# EAGLE design vidc_interposer1 (EAGLE 9.4.2)
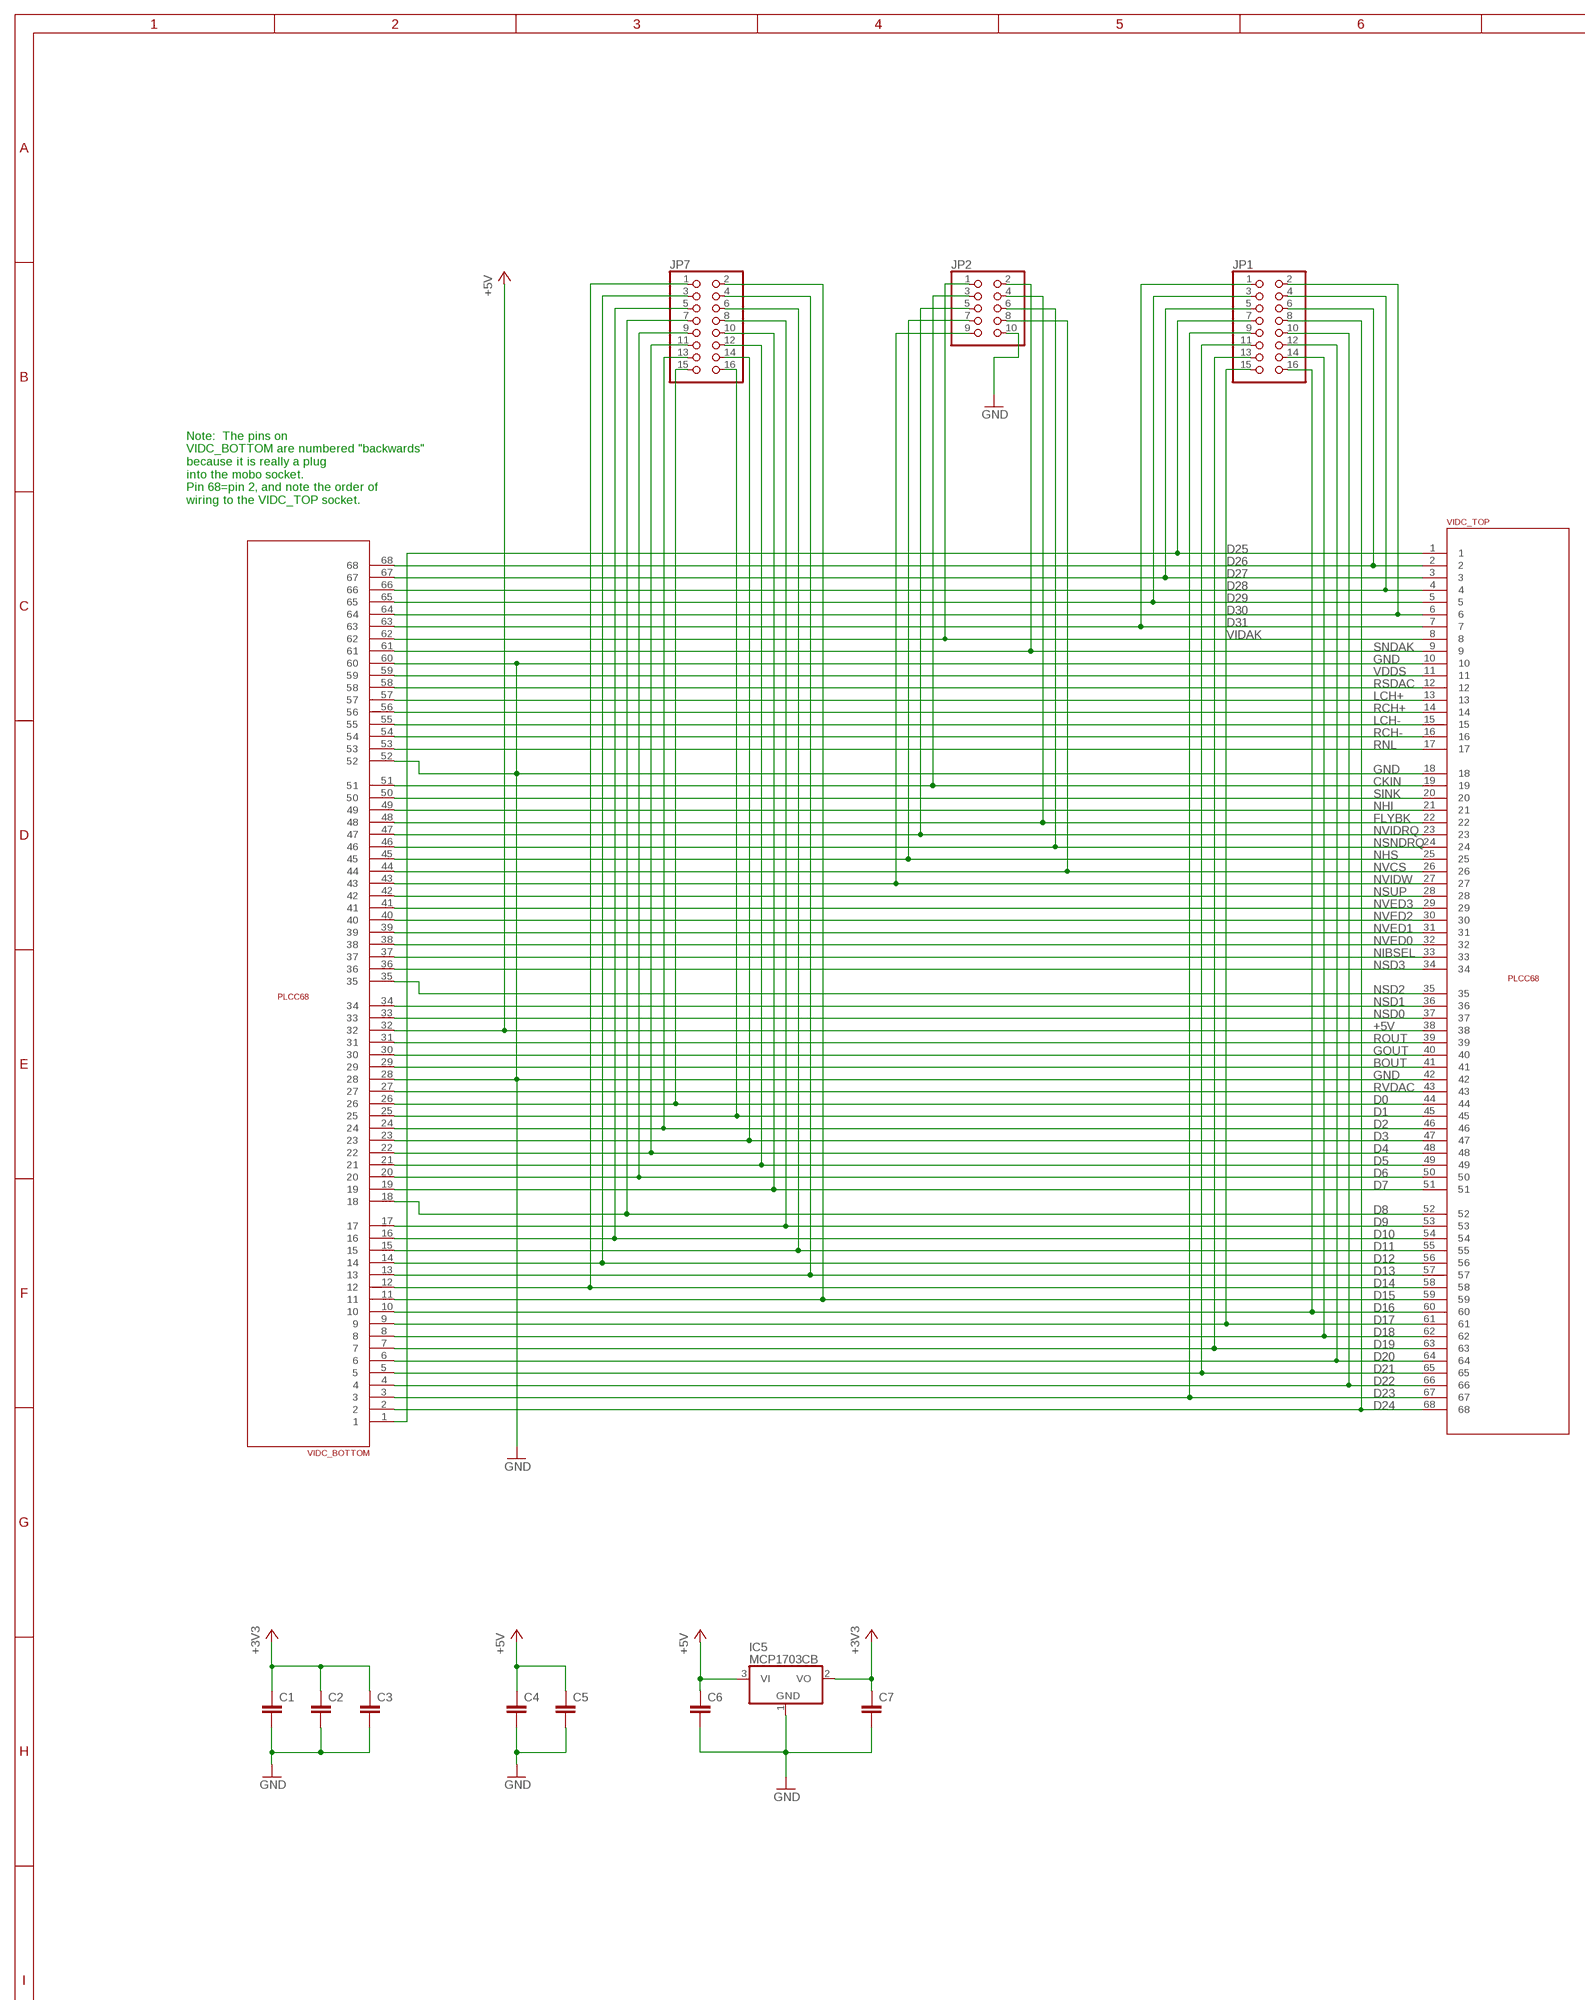
[diagram p0: schematic, sheet 1, part 1 of 2]
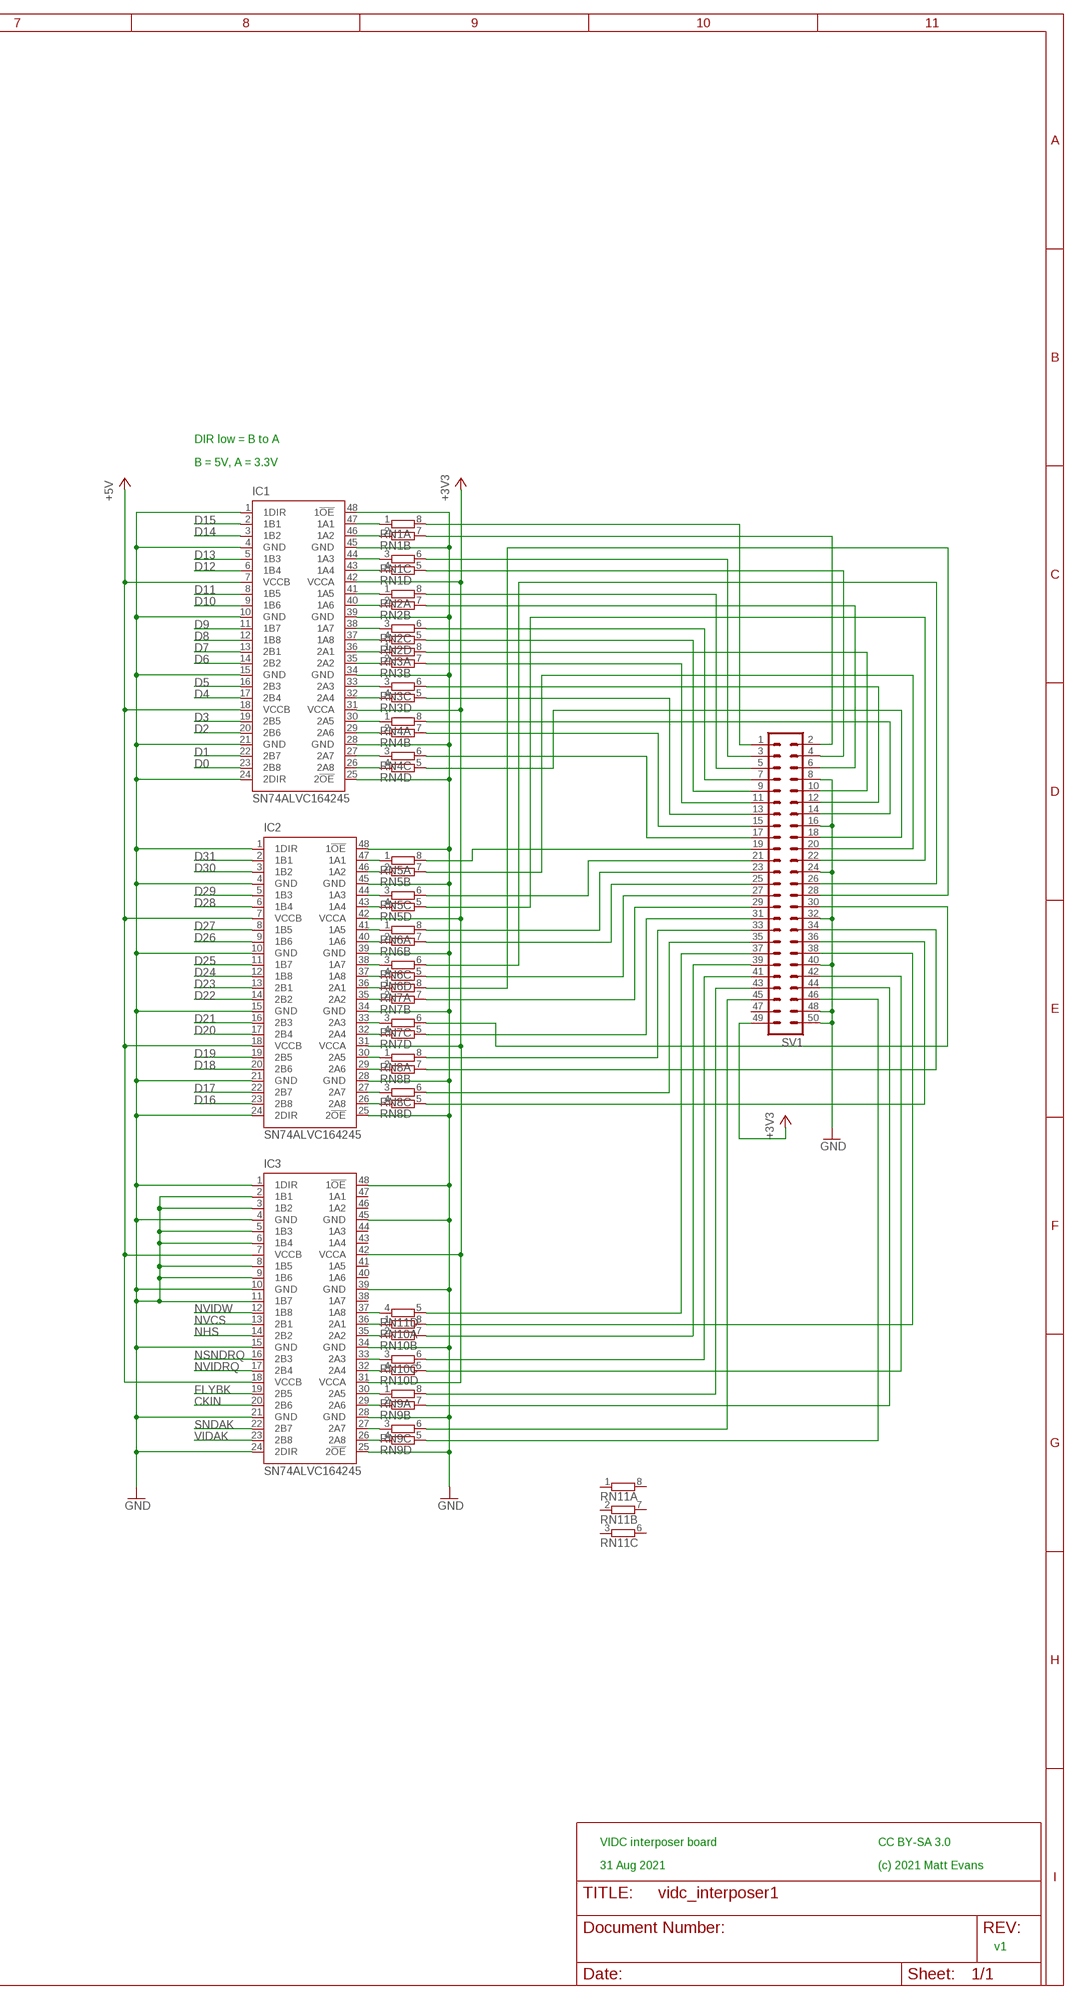
[diagram p1: schematic, sheet 1, part 2 of 2]

## Parts
C1  C-EUC0805  [C0805]
C2  C-EUC0805  [C0805]
C3  C-EUC0805  [C0805]
C4  C-EUC0805  [C0805]
C5  C-EUC0805  [C0805]
C6  C-EUC0805  [C0805]
C7  C-EUC0805  [C0805]
IC1  SN74ALVC164245  [DL_R-PDSO-G48]
IC2  SN74ALVC164245  [DL_R-PDSO-G48]
IC3  SN74ALVC164245  [DL_R-PDSO-G48]
IC5  MCP1703CB  [SOT23]
JP1  PINHD-2X8  [2X08]
JP2  PINHD-2X5  [2X05]
JP7  PINHD-2X8  [2X08]
RN1  4R-NCAY16  [CAY16]
RN2  4R-NCAY16  [CAY16]
RN3  4R-NCAY16  [CAY16]
RN4  4R-NCAY16  [CAY16]
RN5  4R-NCAY16  [CAY16]
RN6  4R-NCAY16  [CAY16]
RN7  4R-NCAY16  [CAY16]
RN8  4R-NCAY16  [CAY16]
RN9  4R-NCAY16  [CAY16]
RN10  4R-NCAY16  [CAY16]
RN11  4R-NCAY16  [CAY16]
SV1  ML50  [ML50]
VIDC_BOTTOM  RAW_PLCC68  [PLCC68S]
VIDC_TOP  RAW_PLCC68  [PLCC68S]

## Nets
+3V3: C1.1 C2.1 C3.1 C7.1 IC1.31(VCCA) IC1.42(VCCA) IC2.31(VCCA) IC2.42(VCCA) IC3.31(VCCA) IC3.42(VCCA) IC5.2(VO) SV1.49
+5V: C4.1 C5.1 C6.1 IC1.7(VCCB) IC1.18(VCCB) IC2.7(VCCB) IC2.18(VCCB) IC3.7(VCCB) IC3.18(VCCB) IC5.3(VI) VIDC_BOTTOM.32 VIDC_TOP.38
BOUT: VIDC_BOTTOM.29 VIDC_TOP.41
CKIN: IC3.20(2B6) JP2.3 VIDC_BOTTOM.51 VIDC_TOP.19
D0: IC1.23(2B8) JP7.15 VIDC_BOTTOM.26 VIDC_TOP.44
D1: IC1.22(2B7) JP7.16 VIDC_BOTTOM.25 VIDC_TOP.45
D2: IC1.20(2B6) JP7.13 VIDC_BOTTOM.24 VIDC_TOP.46
D3: IC1.19(2B5) JP7.14 VIDC_BOTTOM.23 VIDC_TOP.47
D4: IC1.17(2B4) JP7.11 VIDC_BOTTOM.22 VIDC_TOP.48
D5: IC1.16(2B3) JP7.12 VIDC_BOTTOM.21 VIDC_TOP.49
D6: IC1.14(2B2) JP7.9 VIDC_BOTTOM.20 VIDC_TOP.50
D7: IC1.13(2B1) JP7.10 VIDC_BOTTOM.19 VIDC_TOP.51
D8: IC1.12(1B8) JP7.7 VIDC_BOTTOM.18 VIDC_TOP.52
D9: IC1.11(1B7) JP7.8 VIDC_BOTTOM.17 VIDC_TOP.53
D10: IC1.9(1B6) JP7.5 VIDC_BOTTOM.16 VIDC_TOP.54
D11: IC1.8(1B5) JP7.6 VIDC_BOTTOM.15 VIDC_TOP.55
D12: IC1.6(1B4) JP7.3 VIDC_BOTTOM.14 VIDC_TOP.56
D13: IC1.5(1B3) JP7.4 VIDC_BOTTOM.13 VIDC_TOP.57
D14: IC1.3(1B2) JP7.1 VIDC_BOTTOM.12 VIDC_TOP.58
D15: IC1.2(1B1) JP7.2 VIDC_BOTTOM.11 VIDC_TOP.59
D16: IC2.23(2B8) JP1.16 VIDC_BOTTOM.10 VIDC_TOP.60
D17: IC2.22(2B7) JP1.15 VIDC_BOTTOM.9 VIDC_TOP.61
D18: IC2.20(2B6) JP1.14 VIDC_BOTTOM.8 VIDC_TOP.62
D19: IC2.19(2B5) JP1.13 VIDC_BOTTOM.7 VIDC_TOP.63
D20: IC2.17(2B4) JP1.12 VIDC_BOTTOM.6 VIDC_TOP.64
D21: IC2.16(2B3) JP1.11 VIDC_BOTTOM.5 VIDC_TOP.65
D22: IC2.14(2B2) JP1.10 VIDC_BOTTOM.4 VIDC_TOP.66
D23: IC2.13(2B1) JP1.9 VIDC_BOTTOM.3 VIDC_TOP.67
D24: IC2.12(1B8) JP1.8 VIDC_BOTTOM.2 VIDC_TOP.68
D25: IC2.11(1B7) JP1.7 VIDC_BOTTOM.1 VIDC_TOP.1
D26: IC2.9(1B6) JP1.6 VIDC_BOTTOM.68 VIDC_TOP.2
D27: IC2.8(1B5) JP1.5 VIDC_BOTTOM.67 VIDC_TOP.3
D28: IC2.6(1B4) JP1.4 VIDC_BOTTOM.66 VIDC_TOP.4
D29: IC2.5(1B3) JP1.3 VIDC_BOTTOM.65 VIDC_TOP.5
D30: IC2.3(1B2) JP1.2 VIDC_BOTTOM.64 VIDC_TOP.6
D31: IC2.2(1B1) JP1.1 VIDC_BOTTOM.63 VIDC_TOP.7
FLYBK: IC3.19(2B5) JP2.4 VIDC_BOTTOM.48 VIDC_TOP.22
GND: C1.2 C2.2 C3.2 C4.2 C5.2 C6.2 C7.2 IC1.1(1DIR) IC1.4(GND) IC1.10(GND) IC1.15(GND) IC1.21(GND) IC1.24(2DIR) IC1.25(2!OE) IC1.28(GND) IC1.34(GND) IC1.39(GND) IC1.45(GND) IC1.48(1!OE) IC2.1(1DIR) IC2.4(GND) IC2.10(GND) IC2.15(GND) IC2.21(GND) IC2.24(2DIR) IC2.25(2!OE) IC2.28(GND) IC2.34(GND) IC2.39(GND) IC2.45(GND) IC2.48(1!OE) IC3.1(1DIR) IC3.2(1B1) IC3.3(1B2) IC3.4(GND) IC3.5(1B3) IC3.6(1B4) IC3.8(1B5) IC3.9(1B6) IC3.10(GND) IC3.11(1B7) IC3.15(GND) IC3.21(GND) IC3.24(2DIR) IC3.25(2!OE) IC3.28(GND) IC3.34(GND) IC3.39(GND) IC3.45(GND) IC3.48(1!OE) IC5.1(GND) JP2.10 SV1.8 SV1.16 SV1.24 SV1.32 SV1.40 SV1.48 SV1.50 VIDC_BOTTOM.28 VIDC_BOTTOM.52 VIDC_BOTTOM.60 VIDC_TOP.10 VIDC_TOP.18 VIDC_TOP.42
GOUT: VIDC_BOTTOM.30 VIDC_TOP.40
LCH+: VIDC_BOTTOM.57 VIDC_TOP.13
LCH-: VIDC_BOTTOM.55 VIDC_TOP.15
N$1: IC3.26(2A8) RN9.4
N$2: IC3.27(2A7) RN9.3
N$3: IC3.29(2A6) RN9.2
N$4: IC3.30(2A5) RN9.1
N$5: IC3.32(2A4) RN10.4
N$6: IC3.33(2A3) RN10.3
N$7: IC3.35(2A2) RN10.2
N$8: IC3.36(2A1) RN10.1
N$9: IC1.47(1A1) RN1.1
N$10: IC1.46(1A2) RN1.2
N$11: IC1.44(1A3) RN1.3
N$12: IC1.43(1A4) RN1.4
N$13: IC1.41(1A5) RN2.1
N$14: IC1.40(1A6) RN2.2
N$15: IC1.38(1A7) RN2.3
N$16: IC1.37(1A8) RN2.4
N$17: IC1.36(2A1) RN3.1
N$18: IC1.35(2A2) RN3.2
N$19: IC1.33(2A3) RN3.3
N$20: IC1.32(2A4) RN3.4
N$21: IC1.30(2A5) RN4.1
N$22: IC1.29(2A6) RN4.2
N$23: IC3.37(1A8) RN11.4
N$24: IC1.27(2A7) RN4.3
N$25: IC1.26(2A8) RN4.4
N$26: IC2.47(1A1) RN5.1
N$27: IC2.46(1A2) RN5.2
N$28: IC2.44(1A3) RN5.3
N$29: IC2.43(1A4) RN5.4
N$30: IC2.41(1A5) RN6.1
N$31: IC2.40(1A6) RN6.2
N$32: IC2.38(1A7) RN6.3
N$33: IC2.37(1A8) RN6.4
N$34: IC2.36(2A1) RN7.1
N$35: IC2.35(2A2) RN7.2
N$36: IC2.33(2A3) RN7.3
N$37: IC2.32(2A4) RN7.4
N$38: IC2.30(2A5) RN8.1
N$39: IC2.29(2A6) RN8.2
N$40: IC2.27(2A7) RN8.3
N$41: IC2.26(2A8) RN8.4
N$42: RN1.8 SV1.1
N$43: RN1.7 SV1.2
N$44: RN1.6 SV1.3
N$45: RN1.5 SV1.4
N$46: RN5.8 SV1.19
N$47: RN2.8 SV1.5
N$48: RN2.7 SV1.6
N$49: RN2.6 SV1.7
N$50: RN2.5 SV1.9
N$51: RN3.7 SV1.11
N$52: RN5.7 SV1.20
N$53: RN3.8 SV1.10
N$54: RN3.5 SV1.13
N$55: RN3.6 SV1.12
N$56: RN4.7 SV1.15
N$57: RN4.8 SV1.14
N$58: RN4.6 SV1.17
N$59: RN5.5 SV1.22
N$60: RN5.6 SV1.21
N$61: RN4.5 SV1.18
N$62: RN8.5 SV1.36
N$63: RN10.8 SV1.38
N$64: RN6.6 SV1.26
N$65: RN6.8 SV1.23
N$66: RN7.8 SV1.28
N$67: RN6.7 SV1.25
N$68: RN11.5 SV1.37
N$69: RN10.5 SV1.42
N$70: RN6.5 SV1.27
N$71: RN10.7 SV1.39
N$72: RN9.7 SV1.44
N$73: RN9.8 SV1.43
N$86: RN7.7 SV1.29
N$87: RN9.6 SV1.45
N$88: RN7.6 SV1.30
N$89: RN8.7 SV1.34
N$91: RN10.6 SV1.41
N$93: RN7.5 SV1.31
N$94: RN8.8 SV1.33
N$95: RN8.6 SV1.35
N$96: RN9.5 SV1.46
NHI: VIDC_BOTTOM.49 VIDC_TOP.21
NHS: IC3.14(2B2) JP2.7 VIDC_BOTTOM.45 VIDC_TOP.25
NIBSEL: VIDC_BOTTOM.37 VIDC_TOP.33
NSD0: VIDC_BOTTOM.33 VIDC_TOP.37
NSD1: VIDC_BOTTOM.34 VIDC_TOP.36
NSD2: VIDC_BOTTOM.35 VIDC_TOP.35
NSD3: VIDC_BOTTOM.36 VIDC_TOP.34
NSNDRQ: IC3.16(2B3) JP2.6 VIDC_BOTTOM.46 VIDC_TOP.24
NSUP: VIDC_BOTTOM.42 VIDC_TOP.28
NVCS: IC3.13(2B1) JP2.8 VIDC_BOTTOM.44 VIDC_TOP.26
NVED0: VIDC_BOTTOM.38 VIDC_TOP.32
NVED1: VIDC_BOTTOM.39 VIDC_TOP.31
NVED2: VIDC_BOTTOM.40 VIDC_TOP.30
NVED3: VIDC_BOTTOM.41 VIDC_TOP.29
NVIDRQ: IC3.17(2B4) JP2.5 VIDC_BOTTOM.47 VIDC_TOP.23
NVIDW: IC3.12(1B8) JP2.9 VIDC_BOTTOM.43 VIDC_TOP.27
RCH+: VIDC_BOTTOM.56 VIDC_TOP.14
RCH-: VIDC_BOTTOM.54 VIDC_TOP.16
RNL: VIDC_BOTTOM.53 VIDC_TOP.17
ROUT: VIDC_BOTTOM.31 VIDC_TOP.39
RSDAC: VIDC_BOTTOM.58 VIDC_TOP.12
RVDAC: VIDC_BOTTOM.27 VIDC_TOP.43
SINK: VIDC_BOTTOM.50 VIDC_TOP.20
SNDAK: IC3.22(2B7) JP2.2 VIDC_BOTTOM.61 VIDC_TOP.9
VDDS: VIDC_BOTTOM.59 VIDC_TOP.11
VIDAK: IC3.23(2B8) JP2.1 VIDC_BOTTOM.62 VIDC_TOP.8
Unconnected: IC3.38(1A7) IC3.40(1A6) IC3.41(1A5) IC3.43(1A4) IC3.44(1A3) IC3.46(1A2) IC3.47(1A1) RN11.1 RN11.2 RN11.3 RN11.6 RN11.7 RN11.8 SV1.47

## Notes on the sheet
- DIR low = B to A
- B = 5V, A = 3.3V
- Note:  The pins on
  VIDC_BOTTOM are numbered "backwards"
  because it is really a plug
  into the mobo socket.
  Pin 68=pin 2, and note the order of
  wiring to the VIDC_TOP socket.
- VIDC interposer board | CC BY-SA 3.0
- 31 Aug 2021 | (c) 2021 Matt Evans
- v1

## Library data of the parts
C1-C7 = rcl:C-EU: CAPACITOR, European symbol
IC1-IC3 = matt:SN74ALVC164245: 16-BIT BUS TRANSCEIVER WITH 3-STATE OUTPUTS Auto generated by make-symbol-device-package-bsdl.ulp Rev. 33 Source: http://focus.ti.com/lit/ds/symlink/sn74lvcr162245.pdf; MPN: SN74LVCR162245DL; OC_FARNELL: 1739707; OC_NEWARK: 50R6613
IC5 = linear:MCP1703: 250 mA, 16V, Low Quiescent Current LDO Regulator Source: http://ww1.microchip.com/downloads/en/DeviceDoc/22049b.pdf
JP1 JP7 = matt:PINHD-2X8: PIN HEADER
JP2 = pinhead:PINHD-2X5: PIN HEADER
RN1-RN11 = resistor-dil:4R-N: Array Chip Resistor Source: RS Component / Phycomp; OC_FARNELL: unknown; OC_NEWARK: unknown
SV1 = con-harting-ml:ML50: HARTING; OC_FARNELL: unknown; OC_NEWARK: unknown
VIDC_BOTTOM VIDC_TOP = matt:RAW_PLCC68: PLCC68 raw footprint

## Board
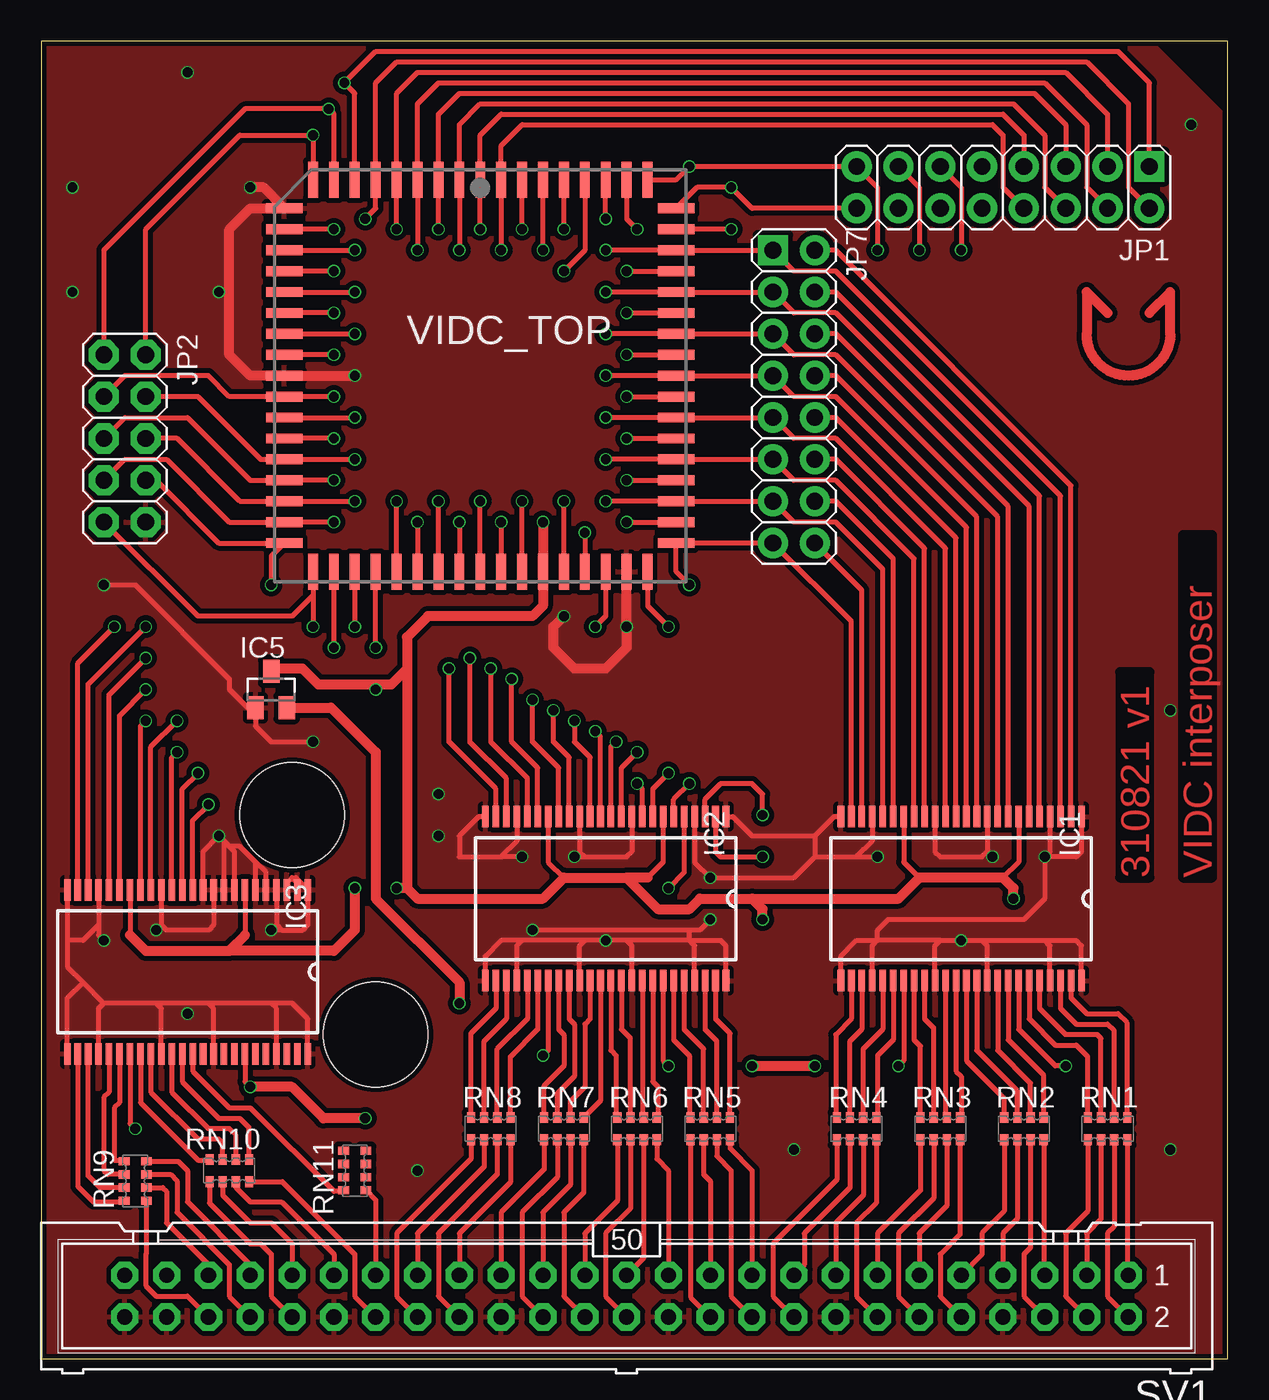
[diagram p2: board, top side]
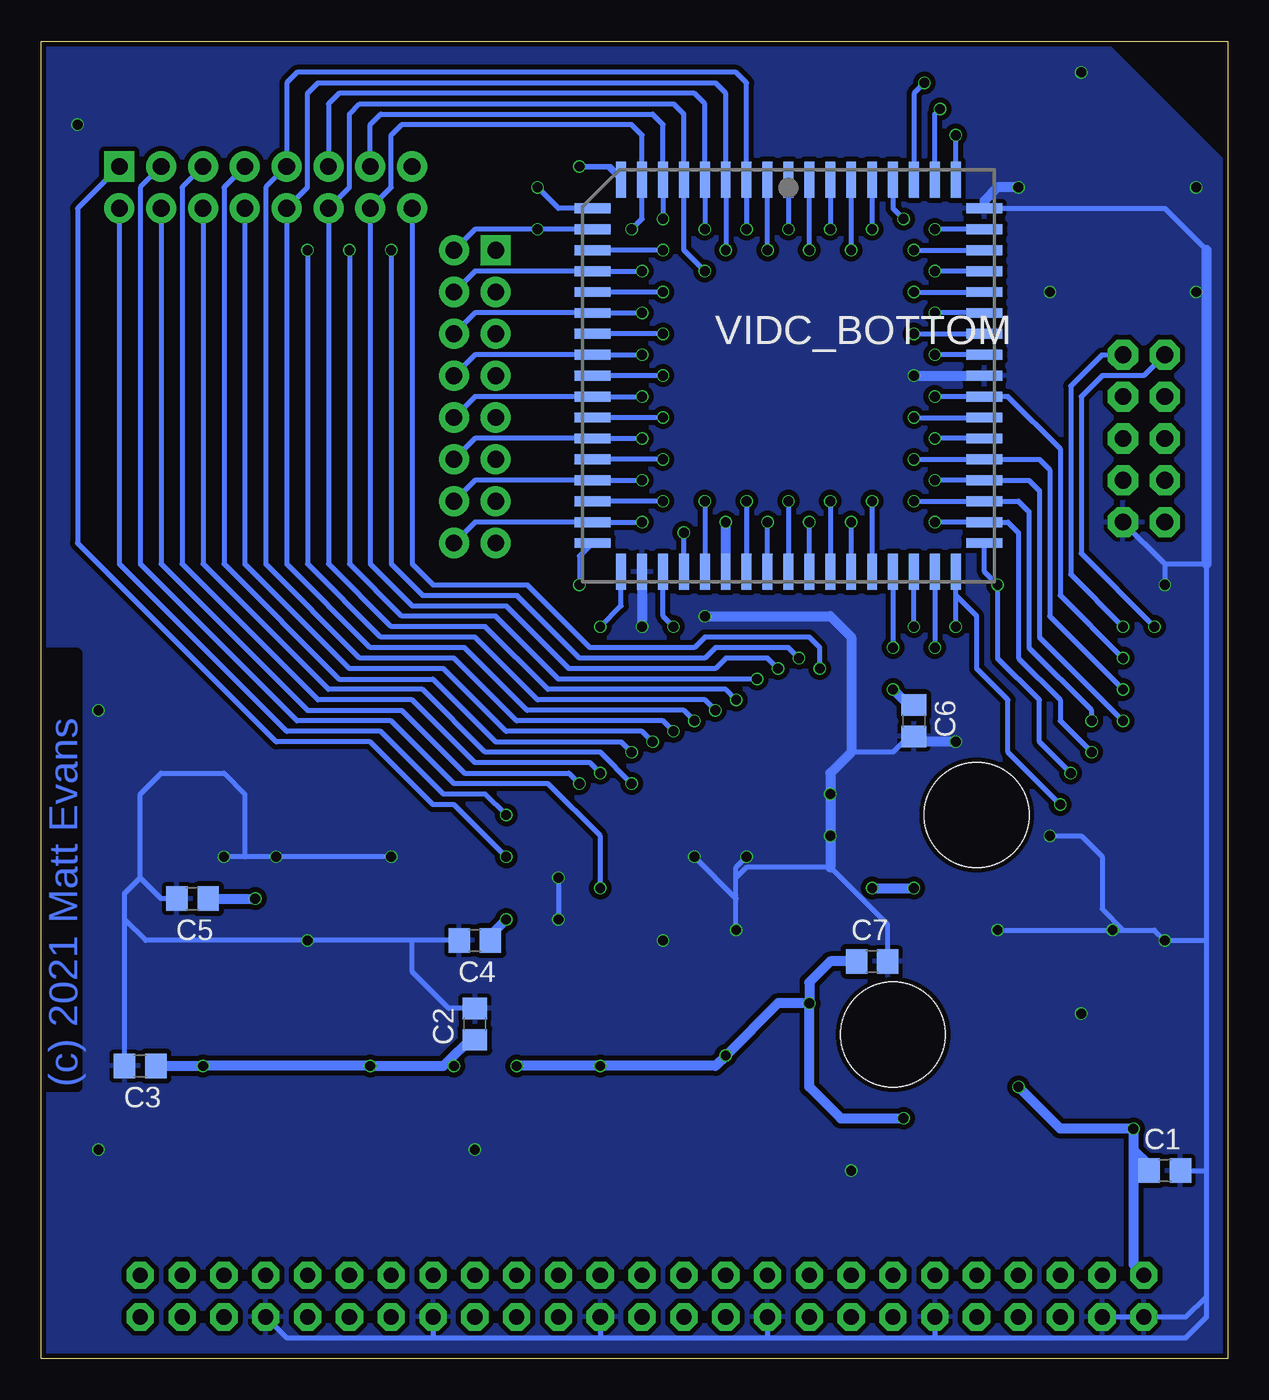
[diagram p3: board, bottom side, seen from below]

Size 72.06 x 80 mm. Coordinates in mm from the lower left corner, seen from the top.
Outline: 0,0 72.06,0 72.06,80 0,80 0,0
Copper layers (1*16): Top 0.035mm / dielectric 1.6mm / Bottom 0.035mm
Design rules "jlcpcb-2layers": minimum track width 5mil, minimum drill 0.3mm, track to track 5mil, track to pad 5mil, pad to pad 5mil, via to via 5mil, smd to smd 5mil, copper to edge 0.2mm, drill to drill 6mil, minimum pad ring 10mil, minimum via ring 3mil, stop-mask expansion 4mil, vias tented up to drill 0mil, thermal gap 10mil
Holes 6.35 mm at 15.24,33.02 20.32,19.68

### Footprints (pad centres in the part's own frame; a part is rotated, then mirrored left to right if it is on the bottom)
C0805 = smd 1.3 x 1.5: 1 -0.95,0; 2 0.95,0
DL_R-PDSO-G48 = smd 1.3 x 0.4: 1 -4.98,7.303; 2 -4.98,6.668; 3 -4.98,6.032; 4 -4.98,5.397; 5 -4.98,4.763; 6 -4.98,4.128; 7 -4.98,3.493; 8 -4.98,2.857; 9 -4.98,2.223; 10 -4.98,1.587; 11 -4.98,0.953; 12 -4.98,0.318; 13 -4.98,-0.318; 14 -4.98,-0.953; 15 -4.98,-1.587; 16 -4.98,-2.223; 17 -4.98,-2.857; 18 -4.98,-3.493; 19 -4.98,-4.128; 20 -4.98,-4.763; 21 -4.98,-5.397; 22 -4.98,-6.032; 23 -4.98,-6.668; 24 -4.98,-7.303; 25 4.98,-7.303; 26 4.98,-6.668; 27 4.98,-6.032; 28 4.98,-5.397; 29 4.98,-4.763; 30 4.98,-4.128; 31 4.98,-3.493; 32 4.98,-2.857; 33 4.98,-2.223; 34 4.98,-1.587; 35 4.98,-0.953; 36 4.98,-0.318; 37 4.98,0.318; 38 4.98,0.953; 39 4.98,1.587; 40 4.98,2.223; 41 4.98,2.857; 42 4.98,3.493; 43 4.98,4.128; 44 4.98,4.763; 45 4.98,5.397; 46 4.98,6.032; 47 4.98,6.668; 48 4.98,7.303
SOT23 = smd 1 x 1.4: 1 -0.95,-1.1; 2 0.95,-1.1; 3 0,1.1
2X08 = drill 1.016 square: 1 -8.89,-1.27 | drill 1.016 pad 1.676: 2 -8.89,1.27; 3 -6.35,-1.27; 4 -6.35,1.27; 5 -3.81,-1.27; 6 -3.81,1.27; 7 -1.27,-1.27; 8 -1.27,1.27; 9 1.27,-1.27; 10 1.27,1.27; 11 3.81,-1.27; 12 3.81,1.27; 13 6.35,-1.27; 14 6.35,1.27; 15 8.89,-1.27; 16 8.89,1.27
2X05 = drill 1.016 octagon: 1 -5.08,-1.27; 2 -5.08,1.27; 3 -2.54,-1.27; 4 -2.54,1.27; 5 0,-1.27; 6 0,1.27; 7 2.54,-1.27; 8 2.54,1.27; 9 5.08,-1.27; 10 5.08,1.27
CAY16 = smd 0.5 x 0.65: 1 -1.2,-0.675; 2 -0.4,-0.675; 3 0.4,-0.675; 4 1.2,-0.675; 5 1.2,0.675; 6 0.4,0.675; 7 -0.4,0.675; 8 -1.2,0.675
ML50 = drill 0.914 octagon: 1 -30.48,-1.27; 2 -30.48,1.27; 3 -27.94,-1.27; 4 -27.94,1.27; 5 -25.4,-1.27; 6 -25.4,1.27; 7 -22.86,-1.27; 8 -22.86,1.27; 9 -20.32,-1.27; 10 -20.32,1.27; 11 -17.78,-1.27; 12 -17.78,1.27; 13 -15.24,-1.27; 14 -15.24,1.27; 15 -12.7,-1.27; 16 -12.7,1.27; 17 -10.16,-1.27; 18 -10.16,1.27; 19 -7.62,-1.27; 20 -7.62,1.27; 21 -5.08,-1.27; 22 -5.08,1.27; 23 -2.54,-1.27; 24 -2.54,1.27; 25 0,-1.27; 26 0,1.27; 27 2.54,-1.27; 28 2.54,1.27; 29 5.08,-1.27; 30 5.08,1.27; 31 7.62,-1.27; 32 7.62,1.27; 33 10.16,-1.27; 34 10.16,1.27; 35 12.7,-1.27; 36 12.7,1.27; 37 15.24,-1.27; 38 15.24,1.27; 39 17.78,-1.27; 40 17.78,1.27; 41 20.32,-1.27; 42 20.32,1.27; 43 22.86,-1.27; 44 22.86,1.27; 45 25.4,-1.27; 46 25.4,1.27; 47 27.94,-1.27; 48 27.94,1.27; 49 30.48,-1.27; 50 30.48,1.27
PLCC68S = smd 0.6 x 2.2: 1 0,11.9; 2 -1.27,11.9; 3 -2.54,11.9; 4 -3.81,11.9; 5 -5.08,11.9; 6 -6.35,11.9; 7 -7.62,11.9; 8 -8.89,11.9; 9 -10.16,11.9; 27 -10.16,-11.9; 28 -8.89,-11.9; 29 -7.62,-11.9; 30 -6.35,-11.9; 31 -5.08,-11.9; 32 -3.81,-11.9; 33 -2.54,-11.9; 34 -1.27,-11.9; 35 0,-11.9; 36 1.27,-11.9; 37 2.54,-11.9; 38 3.81,-11.9; 39 5.08,-11.9; 40 6.35,-11.9; 41 7.62,-11.9; 42 8.89,-11.9; 43 10.16,-11.9; 61 10.16,11.9; 62 8.89,11.9; 63 7.62,11.9; 64 6.35,11.9; 65 5.08,11.9; 66 3.81,11.9; 67 2.54,11.9; 68 1.27,11.9 | smd 2.2 x 0.6: 10 -11.9,10.16; 11 -11.9,8.89; 12 -11.9,7.62; 13 -11.9,6.35; 14 -11.9,5.08; 15 -11.9,3.81; 16 -11.9,2.54; 17 -11.9,1.27; 18 -11.9,0; 19 -11.9,-1.27; 20 -11.9,-2.54; 21 -11.9,-3.81; 22 -11.9,-5.08; 23 -11.9,-6.35; 24 -11.9,-7.62; 25 -11.9,-8.89; 26 -11.9,-10.16; 44 11.9,-10.16; 45 11.9,-8.89; 46 11.9,-7.62; 47 11.9,-6.35; 48 11.9,-5.08; 49 11.9,-3.81; 50 11.9,-2.54; 51 11.9,-1.27; 52 11.9,0; 53 11.9,1.27; 54 11.9,2.54; 55 11.9,3.81; 56 11.9,5.08; 57 11.9,6.35; 58 11.9,7.62; 59 11.9,8.89; 60 11.9,10.16

### Placement (x,y rotation side)
C1  3.81,11.43 0 bottom
C2  45.72,20.32 90 bottom
C3  66.04,17.78 180 bottom
C4  45.72,25.4 180 bottom
C5  62.87,27.94 180 bottom
C6  19.05,38.73 270 bottom
C7  21.59,24.13 0 bottom
IC1  55.88,27.94 270 top
IC2  34.29,27.94 270 top
IC3  8.89,23.5 270 top
IC5  13.97,40.64 0 top
JP1  58.42,71.12 180 top
JP2  5.08,55.88 270 top
JP7  45.72,58.42 270 top
RN1  64.77,13.97 180 top
RN2  59.69,13.97 180 top
RN3  54.61,13.97 180 top
RN4  49.53,13.97 180 top
RN5  40.64,13.97 180 top
RN6  36.2,13.97 180 top
RN7  31.75,13.97 180 top
RN8  27.3,13.97 180 top
RN9  5.71,10.79 270 top
RN10  11.43,11.43 180 top
RN11  19.05,11.43 270 top
SV1  35.56,3.81 180 top
VIDC_BOTTOM  26.67,59.69 0 bottom
VIDC_TOP  26.67,59.69 0 top

### Tracks (layer width: path | path; a pad name or v marks a point on that pad's centre or on a via)
+3V3  (via drill 0.6)
  Top 0.305: IC1.42 59.37,20 61.59,17.78 v62.23,17.78 | IC1.31 52.39,18.1 v52.07,17.78 | IC2.42 37.78,18.1 v38.1,17.78 | IC2.31 30.8,18.73 v30.48,18.41 | IC3.42 12.38,16.83 v12.7,16.51 | IC3.31 5.4,14.29 v5.71,13.97
  Top 0.61: v43.18,17.78 v46.99,17.78 | v25.4,21.59 25.4,22.86 20.32,27.94 20.32,36.83 17.61,39.54 IC5.2 | v19.68,14.61 17.14,14.61 15.24,16.51 v12.7,16.51
  Bottom 0.305: 45.72,19.68 C2.1 | v46.99,17.78 47.62,17.78 | C1.1 4.76,11.74
  Bottom 0.61: C3.1 v62.23,17.78 v52.07,17.78 47.62,17.78 45.72,19.68 | v43.18,17.78 v38.1,17.78 31.11,17.78 v30.48,18.41 27.3,21.59 v25.4,21.59 | v12.7,16.51 10.16,13.97 v5.71,13.97 5.71,12.7 | 5.71,12.7 5.71,5.71 SV1.49 | v25.4,21.59 25.4,16.51 23.5,14.61 v19.68,14.61 | 4.76,11.74 5.71,12.7 | C7.1 24.13,24.13 25.4,22.86 v25.4,21.59
+5V  (via drill 0.6)
  Top 0.305: IC1.7 59.37,30.16 58.42,29.21 | 53.34,29.21 52.39,30.16 IC1.18 | IC2.7 37.78,30.16 36.83,29.21 | IC2.18 30.8,30.16 31.75,29.21 | 14.14,41.91 IC5.3 | v20.32,40.64 v20.32,40.63 20,40.95 | IC3.18 5.4,25.72 | IC3.7 12.38,25.72
  Top 0.61: v30.48,50.8 VIDC_BOTTOM.32 30.48,45.72 29.84,45.09 23.5,45.09 22.23,43.81 22.23,41.91 | 22.23,41.91 22.23,28.57 | 22.23,28.57 22.86,27.94 30.48,27.94 31.75,29.21 35.56,29.21 | 43.18,27.94 40.01,27.94 39.37,27.3 37.47,27.3 35.56,29.21 | 43.18,27.94 52.07,27.94 53.34,29.21 58.42,29.21 59.05,28.57 v59.05,27.94 | v43.81,26.67 43.81,27.3 43.18,27.94 | 14.14,41.91 15.88,41.91 16.83,40.95 20,40.95 21.27,40.95 22.23,41.91 | 5.4,25.72 6.35,24.77 11.43,24.77 | 12.38,25.72 11.43,24.77 | 22.23,28.57 v21.59,28.57 | v19.05,28.57 19.05,26.04 17.78,24.77 11.43,24.77 | 36.83,29.21 35.56,29.21
  Bottom 0.305: C4.1 44.77,25.71 | C6.1 19.36,39.69
  Bottom 0.61: VIDC_BOTTOM.32 v30.48,50.8 | C5.1 v59.05,27.94 | 44.77,25.71 v43.81,26.67 | 19.36,39.69 v20.32,40.64 | v21.59,28.57 v19.05,28.57
BOUT  (via drill 0.6)
  Top 0.305: VIDC_BOTTOM.29 34.29,45.09 v33.66,44.45
  Bottom 0.305: v33.66,44.45 34.29,45.09 VIDC_BOTTOM.29
CKIN  (via drill 0.6)
  Top 0.305: v17.78,58.42 VIDC_BOTTOM.51 11.43,58.42 10.16,59.69 5.08,59.69 JP2.3 | IC3.20 4.13,40.32 v6.35,42.55
  Bottom 0.305: v17.78,58.42 VIDC_BOTTOM.51 13.34,58.42 10.16,55.24 10.16,46.35 v6.35,42.55
D0  (via drill 0.6)
  Top 0.305: v39.37,46.99 38.57,47.79 VIDC_BOTTOM.26 JP7.15 49.21,44.77 IC1.23
  Bottom 0.305: VIDC_BOTTOM.26 39.37,48.73 v39.37,46.99
D1  (via drill 0.6)
  Top 0.305: v35.56,50.8 VIDC_BOTTOM.25 | IC1.22 49.85,46.67 JP7.16
  Bottom 0.305: v35.56,50.8 VIDC_BOTTOM.25 45.72,50.8 JP7.16
D2  (via drill 0.6)
  Top 0.305: v34.29,52.07 VIDC_BOTTOM.24 JP7.13 45.72,50.8 48.26,50.8 51.12,47.94 IC1.20
  Bottom 0.305: v34.29,52.07 VIDC_BOTTOM.24
D3  (via drill 0.6)
  Top 0.305: v35.56,53.34 VIDC_BOTTOM.23 | IC1.19 51.75,48.58 48.26,52.07 JP7.14
  Bottom 0.305: v35.56,53.34 VIDC_BOTTOM.23 45.72,53.34 JP7.14
D4  (via drill 0.6)
  Top 0.305: v34.29,54.61 VIDC_BOTTOM.22 JP7.11 45.72,53.34 48.26,53.34 53.02,48.58 IC1.17
  Bottom 0.305: v34.29,54.61 VIDC_BOTTOM.22
D5  (via drill 0.6)
  Top 0.305: v35.56,55.88 VIDC_BOTTOM.21 | IC1.16 53.66,49.21 48.26,54.61 JP7.12
  Bottom 0.305: v35.56,55.88 VIDC_BOTTOM.21 45.72,55.88 JP7.12
D6  (via drill 0.6)
  Top 0.305: v34.29,57.15 VIDC_BOTTOM.20 JP7.9 45.72,55.88 48.26,55.88 54.93,49.21 IC1.14
  Bottom 0.305: v34.29,57.15 VIDC_BOTTOM.20
D7  (via drill 0.6)
  Top 0.305: v35.56,58.42 VIDC_BOTTOM.19 | IC1.13 55.56,49.85 48.26,57.15 JP7.10
  Bottom 0.305: v35.56,58.42 VIDC_BOTTOM.19 45.72,58.42 JP7.10
D8  (via drill 0.6)
  Top 0.305: v34.29,59.69 VIDC_BOTTOM.18 JP7.7 45.72,58.42 48.26,58.42 56.2,50.48 IC1.12
  Bottom 0.305: v34.29,59.69 VIDC_BOTTOM.18
D9  (via drill 0.6)
  Top 0.305: v35.56,60.96 VIDC_BOTTOM.17 | IC1.11 56.83,51.12 48.26,59.69 JP7.8
  Bottom 0.305: v35.56,60.96 VIDC_BOTTOM.17 45.72,60.96 JP7.8
D10  (via drill 0.6)
  Top 0.305: v34.29,62.23 VIDC_BOTTOM.16 JP7.5 45.72,60.96 48.26,60.96 58.1,51.12 IC1.9
  Bottom 0.305: v34.29,62.23 VIDC_BOTTOM.16
D11  (via drill 0.6)
  Top 0.305: v35.56,63.5 VIDC_BOTTOM.15 | IC1.8 58.74,51.75 48.26,62.23 JP7.6
  Bottom 0.305: v35.56,63.5 VIDC_BOTTOM.15 45.72,63.5 JP7.6
D12  (via drill 0.6)
  Top 0.305: v34.29,64.77 VIDC_BOTTOM.14 JP7.3 45.72,63.5 48.26,63.5 60.01,51.75 IC1.6
  Bottom 0.305: v34.29,64.77 VIDC_BOTTOM.14
D13  (via drill 0.6)
  Top 0.305: v35.56,66.04 VIDC_BOTTOM.13 | IC1.5 60.64,52.39 48.26,64.77 JP7.4
  Bottom 0.305: v35.56,66.04 VIDC_BOTTOM.13 45.72,66.04 JP7.4
D14  (via drill 0.6)
  Top 0.305: v34.29,67.31 VIDC_BOTTOM.12 JP7.1 45.72,66.04 48.26,66.04 61.91,52.39 IC1.3
  Bottom 0.305: v34.29,67.31 VIDC_BOTTOM.12
D15  (via drill 0.6)
  Top 0.305: v41.91,68.58 VIDC_BOTTOM.11 | IC1.2 62.55,53.02 48.26,67.31 JP7.2
  Bottom 0.305: VIDC_BOTTOM.11 v41.91,68.58 45.72,68.58 JP7.2
D16  (via drill 0.6)
  Top 0.305: VIDC_BOTTOM.10 39.84,71.12 v41.91,71.12 43.18,69.85 JP1.16 | IC2.23 27.62,34.61 24.77,37.47 v24.77,41.91
  Bottom 0.305: VIDC_BOTTOM.10 40.64,69.85 v41.91,71.12 | JP1.16 49.53,48.26 48.26,46.99 42.55,46.99 38.73,43.18 32.38,43.18 31.75,43.81 25.4,43.81 24.77,43.18 v24.77,41.91
D17  (via drill 0.6)
  Top 0.305: VIDC_BOTTOM.9 38.57,71.59 v39.37,72.39 JP1.15 50.8,71.12 v50.8,67.31 | v26.04,42.55 26.04,37.47 28.26,35.24 IC2.22
  Bottom 0.305: v50.8,67.31 50.8,48.26 48.9,46.35 43.18,46.35 39.37,42.55 31.75,42.55 31.11,43.18 26.67,43.18 v26.04,42.55 | v39.37,72.39 37.63,72.39 VIDC_BOTTOM.9 36.83,71.75 37.47,72.39 v39.37,72.39
D18  (via drill 0.6)
  Top 0.305: VIDC_BOTTOM.8 35.56,69.22 v36.2,68.58 | v27.3,41.91 27.3,37.47 29.53,35.24 IC2.20
  Bottom 0.305: v36.2,68.58 35.56,69.22 VIDC_BOTTOM.8 35.56,74.3 36.2,74.93 50.16,74.93 50.8,74.3 50.8,71.12 JP1.14 52.07,48.26 49.53,45.72 43.81,45.72 40.01,41.91 31.11,41.91 30.48,42.55 27.94,42.55 v27.3,41.91
D19  (via drill 0.6)
  Top 0.305: v34.29,69.22 VIDC_BOTTOM.7 | JP1.13 53.34,71.12 v53.34,67.31 | IC2.19 30.16,35.88 28.57,37.47 v28.57,41.27
  Bottom 0.305: v34.29,69.22 VIDC_BOTTOM.7 34.29,74.93 34.92,75.56 51.44,75.56 52.07,74.93 JP1.13 | v53.34,67.31 53.34,48.26 50.16,45.09 44.45,45.09 40.64,41.27 v28.57,41.27
D20  (via drill 0.6)
  Top 0.305: VIDC_BOTTOM.6 33.02,67.31 v31.75,66.04 | IC2.17 31.43,35.88 29.84,37.47 v29.84,40.01
  Bottom 0.305: v31.75,66.04 33.02,67.31 VIDC_BOTTOM.6 33.02,75.56 33.66,76.2 52.7,76.2 53.34,75.56 53.34,71.12 JP1.12 54.61,48.26 50.8,44.45 45.09,44.45 41.27,40.64 30.48,40.64 v29.84,40.01
D21  (via drill 0.6)
  Top 0.305: v31.75,68.58 VIDC_BOTTOM.5 | JP1.11 55.88,71.12 v55.88,67.31 | IC2.16 32.07,36.51 31.11,37.47 v31.11,39.37
  Bottom 0.305: v31.75,68.58 VIDC_BOTTOM.5 31.75,76.2 32.38,76.83 53.98,76.83 54.61,76.2 JP1.11 | v55.88,67.31 55.88,48.26 51.44,43.81 45.72,43.81 41.91,40.01 31.75,40.01 v31.11,39.37
D22  (via drill 0.6)
  Top 0.305: v30.48,67.31 VIDC_BOTTOM.4 | IC2.14 33.34,36.51 32.38,37.47 v32.38,38.73
  Bottom 0.305: v30.48,67.31 VIDC_BOTTOM.4 30.48,76.83 31.11,77.47 55.24,77.47 55.88,76.83 55.88,71.12 JP1.10 57.15,48.26 52.07,43.18 46.35,43.18 42.55,39.37 33.02,39.37 v32.38,38.73
D23  (via drill 0.6)
  Top 0.305: v29.21,68.58 VIDC_BOTTOM.3 | IC2.13 33.97,37.78 v33.66,38.1
  Bottom 0.305: v29.21,68.58 VIDC_BOTTOM.3 29.21,77.47 29.84,78.11 56.52,78.11 57.15,77.47 JP1.9 58.42,71.12 58.42,48.26 52.7,42.55 46.99,42.55 43.18,38.73 34.29,38.73 v33.66,38.1
D24  (via drill 0.6)
  Top 0.305: v27.94,67.31 VIDC_BOTTOM.2 27.94,73.66 29.21,74.93 57.78,74.93 58.42,74.3 58.42,71.12 JP1.8 | IC2.12 34.61,37.15 v34.92,37.47
  Bottom 0.305: v27.94,67.31 VIDC_BOTTOM.2 | JP1.8 59.69,48.26 53.34,41.91 47.62,41.91 43.81,38.1 35.56,38.1 v34.92,37.47
D25  (via drill 0.6)
  Top 0.305: v26.67,68.58 VIDC_BOTTOM.1 26.67,74.3 27.94,75.56 58.42,75.56 59.69,74.3 JP1.7 | v36.2,36.83 35.24,35.88 IC2.11
  Bottom 0.305: VIDC_BOTTOM.1 v26.67,68.58 | JP1.7 60.96,71.12 60.96,48.26 53.98,41.27 48.26,41.27 44.45,37.47 36.83,37.47 v36.2,36.83
D26  (via drill 0.6)
  Top 0.305: v25.4,67.31 VIDC_BOTTOM.68 25.4,74.93 26.67,76.2 59.05,76.2 60.96,74.3 60.96,71.12 JP1.6 | IC2.9 36.51,34.61 v36.2,34.92
  Bottom 0.305: v25.4,67.31 VIDC_BOTTOM.68 | JP1.6 62.23,48.26 54.61,40.64 48.9,40.64 45.09,36.83 38.1,36.83 v36.2,34.92
D27  (via drill 0.6)
  Top 0.305: v24.13,68.58 VIDC_BOTTOM.67 24.13,75.56 25.4,76.83 60.33,76.83 62.23,74.93 JP1.5 | IC2.8 37.15,34.61 v38.1,35.56
  Bottom 0.305: VIDC_BOTTOM.67 v24.13,68.58 | JP1.5 63.5,71.12 63.5,48.26 55.24,40.01 49.53,40.01 45.72,36.2 38.73,36.2 v38.1,35.56
D28  (via drill 0.6)
  Top 0.305: v22.86,67.31 VIDC_BOTTOM.66 22.86,76.2 24.13,77.47 60.96,77.47 63.5,74.93 63.5,71.12 JP1.4 | v39.37,34.92 38.42,33.97 IC2.6
  Bottom 0.305: v22.86,67.31 VIDC_BOTTOM.66 | JP1.4 64.77,48.26 55.88,39.37 50.16,39.37 46.35,35.56 40.01,35.56 v39.37,34.92
D29  (via drill 0.6)
  Top 0.305: v21.59,68.58 VIDC_BOTTOM.65 21.59,76.83 22.86,78.11 62.23,78.11 64.77,75.56 JP1.3 | IC2.5 39.05,29.53 v38.1,28.57
  Bottom 0.305: VIDC_BOTTOM.65 v21.59,68.58 | JP1.3 66.04,71.12 66.04,48.26 56.52,38.73 50.8,38.73 46.99,34.92 41.27,34.92 38.1,31.75 v38.1,28.57
D30  (via drill 0.6)
  Top 0.305: v19.68,69.22 20.32,69.85 VIDC_BOTTOM.64 20.32,77.47 21.59,78.74 63.5,78.74 66.04,76.2 66.04,71.12 JP1.2 | IC2.3 40.32,33.97 41.27,34.92 43.18,34.92 43.81,34.29 v43.81,33.02
  Bottom 0.305: VIDC_BOTTOM.64 20.32,69.85 v19.68,69.22 | JP1.2 67.31,48.26 57.15,38.1 51.44,38.1 47.62,34.29 45.09,34.29 v43.81,33.02
D31  (via drill 0.6)
  Top 0.305: VIDC_BOTTOM.63 19.05,76.83 v18.41,77.47 20.32,79.38 65.41,79.38 67.31,77.47 JP1.1 | IC2.2 40.96,30.8 41.27,30.48 v43.81,30.48
  Bottom 0.305: v18.41,77.47 19.05,76.83 VIDC_BOTTOM.63 | JP1.1 69.85,69.85 69.85,49.53 57.78,37.47 52.07,37.47 48.26,33.66 46.99,33.66 v43.81,30.48
FLYBK  (via drill 0.6)
  Top 0.305: v19.05,54.61 VIDC_BOTTOM.48 13.34,54.61 9.53,58.42 JP2.4 | IC3.19 4.76,39.05 v6.35,40.64
  Bottom 0.305: v19.05,54.61 VIDC_BOTTOM.48 11.43,54.61 10.79,53.98 10.79,45.09 v6.35,40.64
GND  (via drill 0.6)
  Top 0.305: IC1.15 54.29,30.8 54.61,30.48 57.15,30.48 57.47,30.8 | IC1.10 57.47,30.8 | IC1.4 61.28,30.8 v60.96,30.48 | IC1.24 48.16,32.92 46.99,31.75 | IC1.21 50.48,31.43 49.53,30.48 | IC1.1 63.18,30.8 62.87,30.48 v60.96,30.48 | 46.99,31.75 46.99,30.48 | 46.99,30.48 49.53,30.48 | 57.47,30.8 v57.78,30.48 | v60.96,30.48 60.96,27.94 59.69,26.67 51.44,26.67 50.8,26.04 50.8,25.4 | 49.53,30.48 v50.8,30.48 | IC1.28 50.48,25.08 50.8,25.4 | IC1.25 48.58,24.45 49.53,25.4 50.8,25.4 | IC1.34 54.29,25.08 54.61,25.4 | 54.61,25.4 57.15,25.4 | 57.15,25.4 60.96,25.4 | 60.96,25.4 62.87,25.4 63.18,25.08 IC1.48 | IC1.45 61.28,25.08 60.96,25.4 | IC1.39 57.47,25.08 57.15,25.4 | 54.61,25.4 50.8,25.4 | IC2.1 42.01,32.92 43.18,31.75 46.99,31.75 | IC2.4 39.69,30.16 v40.64,29.21 45.72,29.21 46.99,30.48 | IC2.24 26.57,32.92 25.4,31.75 25.4,30.48 27.94,30.48 | IC2.21 28.89,31.43 27.94,30.48 | IC2.15 32.7,30.8 33.02,30.48 | 33.02,30.48 35.56,30.48 35.88,30.8 IC2.10 | 39.37,26.04 40.01,26.04 v40.64,26.67 | 39.37,26.04 v29.84,26.04 | v32.38,30.48 33.02,30.48 | v29.21,30.48 27.94,30.48 | IC2.45 39.69,25.08 39.37,25.4 | 39.37,25.4 41.27,25.4 41.59,25.08 IC2.48 | 39.37,25.4 35.56,25.4 | 35.56,25.4 33.02,25.4 | 33.02,25.4 29.21,25.4 | 29.21,25.4 27.94,25.4 26.99,24.45 IC2.25 | IC2.28 28.89,25.08 29.21,25.4 | IC2.34 32.7,25.08 33.02,25.4 | IC2.39 35.88,25.08 35.56,25.4 | 39.37,25.4 39.37,26.04 | v3.81,46.99 5.71,46.99 11.43,41.27 11.43,40.64 12.7,39.37 12.85,39.37 IC5.1 13.02,38.41 13.97,37.47 v16.51,37.47 | IC3.24 1.59,25.4 | 1.59,25.4 1.59,23.81 2.54,22.86 | IC3.25 1.59,21.91 2.54,22.86 | IC3.48 16.19,20.64 15.24,21.59 13.97,21.59 | 13.97,21.59 10.16,21.59
  Top 0.305: 10.16,21.59 6.99,21.59 | 6.99,21.59 3.81,21.59 | 3.81,21.59 2.54,22.86 | IC3.45 14.29,21.27 13.97,21.59 | IC3.39 10.48,21.27 10.16,21.59 | IC3.34 7.3,21.27 6.99,21.59 | IC3.28 3.49,21.27 3.81,21.59 | 1.59,25.4 2.54,25.4 3.49,26.35 IC3.21 3.49,25.72 v3.81,25.4 | IC3.15 7.3,26.35 | 7.3,26.35 7.62,26.04 10.16,26.04 10.48,26.35 IC3.10 | 7.3,26.35 v6.99,26.04 | IC3.11 9.84,30.8 v10.79,31.75 | IC3.9 11.11,31.43 v10.79,31.75 | IC3.8 11.75,30.8 v10.79,31.75 | 14.61,26.04 15.88,26.04 16.19,26.35 IC3.1 15.46,29.21 15.24,29.21 | 14.29,26.35 14.61,26.04 | 14.61,26.04 v13.97,26.04 14.29,26.35 | IC3.3 14.92,28.89 15.24,29.21 | IC3.5 13.65,29.53 13.02,30.16 | 13.02,30.16 12.06,31.11 11.43,31.11 v10.79,31.75 | IC3.6 13.02,30.16 | IC3.2 15.56,28.89 15.24,29.21 | IC3.4 14.29,26.35
  Top 0.61: v19.05,59.69 VIDC_BOTTOM.52 12.7,59.69 11.43,60.96 11.43,68.58 12.7,69.85 VIDC_BOTTOM.60 13.5,71.12 v12.7,71.12 | VIDC_BOTTOM.28 v35.56,44.45 35.56,43.18 34.29,41.91 32.38,41.91 31.11,43.18 31.11,44.45 v31.75,45.09
  Bottom 0.305: 59.69,30.48 v57.78,30.48 v50.8,30.48 | 59.69,30.48 v60.96,30.48 | v29.84,26.04 29.84,27.94 | 29.84,27.94 v32.38,30.48 | 29.84,27.94 29.84,29.21 | 29.84,29.21 29.84,29.84 v29.21,30.48 | v40.64,29.21 v40.64,26.67 | 67.31,17.78 C3.2 66.99,26.67 | C5.2 64.77,27.94 66.04,29.21 | 66.04,29.21 66.04,34.29 64.77,35.56 60.96,35.56 59.69,34.29 59.69,30.48 | 66.99,26.67 66.99,28.26 66.04,29.21 | C4.2 49.53,25.4 | 49.53,25.4 65.72,25.4 66.99,26.67 | C2.2 47.3,21.27 49.53,23.5 49.53,25.4 | 22.86,36.83 20.32,36.83 19.36,37.78 C6.2 18.73,37.47 | 29.84,29.21 29.21,29.84 24.13,29.84 20.64,26.36 C7.2 | VIDC_BOTTOM.60 3.81,69.85 1.27,67.31 | JP2.10 3.81,48.26 | 3.81,48.26 1.27,48.26 1.27,25.4 | 3.81,48.26 v3.81,46.99 | SV1.50 SV1.48 2.54,2.54 1.27,3.81 | 1.27,3.81 1.27,11.43 | 1.27,11.43 1.27,25.4 | C1.2 1.27,11.43 | 1.27,25.4 v3.81,25.4 4.45,26.04 6.35,26.04 | 6.35,26.04 v6.99,26.04 v13.97,26.04 | v10.79,31.75 8.89,31.75 7.62,30.48 7.62,27.3 6.35,26.04 | SV1.8 57.15,1.27 48.26,1.27 | 48.26,1.27 38.1,1.27 | 38.1,1.27 27.94,1.27 | 27.94,1.27 17.78,1.27 | 17.78,1.27 2.54,1.27 1.27,2.54 1.27,3.81 | SV1.40 17.78,1.27 | SV1.32 27.94,1.27 | SV1.24 38.1,1.27 | SV1.16 48.26,1.27
  Bottom 0.61: 24.13,29.84 24.13,35.56 22.86,36.83 22.86,43.81 24.13,45.09 v31.75,45.09 | v19.05,59.69 VIDC_BOTTOM.52 | v12.7,71.12 13.97,71.12 14.77,70.32 VIDC_BOTTOM.60 | VIDC_BOTTOM.28 v35.56,44.45 | 1.27,48.26 1.27,67.31 | v16.51,37.47 18.73,37.47
  other vias: 45.72,12.7 68.58,12.7 22.86,11.43 68.58,39.37 55.88,25.4 34.29,25.4 8.89,20.95 1.91,71.12 1.91,64.77 10.79,64.77 24.13,31.75 24.13,34.29 8.89,78.11 69.85,74.93
  pour Bottom (isolate 0.305): 0,72.39 7.62,80.01 72.39,80.01 72.39,0 0,0
  pour Top (isolate 0.305): 0,80.01 67.31,80.01 72.39,74.93 72.39,0 0,0
GOUT  (via drill 0.6)
  Top 0.305: v33.02,50.16 VIDC_BOTTOM.30
  Bottom 0.305: VIDC_BOTTOM.30 v33.02,50.16
LCH+  (via drill 0.6)
  Top 0.305: v17.78,66.04 VIDC_BOTTOM.57
  Bottom 0.305: VIDC_BOTTOM.57 v17.78,66.04
LCH-  (via drill 0.6)
  Top 0.305: v17.78,63.5 VIDC_BOTTOM.55
  Bottom 0.305: VIDC_BOTTOM.55 v17.78,63.5
N$1
  Top 0.305: RN9.4 4.97,9.53 3.17,9.53 2.22,10.48 IC3.26
N$2
  Top 0.305: RN9.3 3.58,10.39 2.86,11.11 IC3.27
N$3
  Top 0.305: IC3.29 4.13,16.19 3.81,15.88 3.81,11.43 4.04,11.2 RN9.2
N$4
  Top 0.305: IC3.30 4.76,15.56 4.45,15.24 4.45,12.06 4.97,12.06 RN9.1
N$5
  Top 0.305: IC3.32 6.03,15.56 9.53,12.06 10.19,12.06 RN10.4
N$6
  Top 0.305: IC3.33 6.67,16.19 9.53,13.34 10.79,13.34 11.03,13.1 RN10.3
N$7
  Top 0.305: IC3.35 7.94,16.19 10.16,13.97 11.43,13.97 11.83,13.57 RN10.2
N$8
  Top 0.305: IC3.36 8.57,16.83 10.79,14.61 12.06,14.61 12.63,14.04 RN10.1
N$9
  Top 0.305: IC1.47 62.55,21.91 63.5,20.95 65.41,20.95 65.97,20.39 RN1.1
N$10
  Top 0.305: IC1.46 61.91,21.27 62.87,20.32 64.77,20.32 65.17,19.92 RN1.2
N$11
  Top 0.305: IC1.44 60.64,21.27 62.23,19.68 64.14,19.68 64.37,19.45 RN1.3
N$12
  Top 0.305: IC1.43 60.01,20.64 61.59,19.05 62.87,19.05 63.57,18.34 RN1.4
N$13
  Top 0.305: IC1.41 58.74,19.37 60.89,17.21 RN2.1
N$14
  Top 0.305: IC1.40 58.1,18.73 60.09,16.75 RN2.2
N$15
  Top 0.305: IC1.38 56.83,18.73 59.29,16.27 RN2.3
N$16
  Top 0.305: IC1.37 56.2,18.1 58.49,15.8 RN2.4
N$17
  Top 0.305: IC1.36 55.56,17.46 55.88,17.14 55.88,14.71 RN3.1
N$18
  Top 0.305: IC1.35 54.93,14.73 RN3.2
N$19
  Top 0.305: IC1.33 53.66,20.64 54.21,20.09 RN3.3
N$20
  Top 0.305: IC1.32 53.02,19.37 53.41,18.98 RN3.4
N$21
  Top 0.305: IC1.30 51.75,19.37 50.8,18.41 50.8,14.71 RN4.1
N$22
  Top 0.305: RN4.2 49.93,18.82 51.12,20 IC1.29
N$23
  Top 0.305: IC3.37 9.21,17.46 11.43,15.24 12.7,15.24 17.78,10.16 18.3,10.16 RN11.4
N$24
  Top 0.305: IC1.27 49.85,20 49.13,19.29 RN4.3
N$25
  Top 0.305: IC1.26 49.21,20.64 48.26,19.68 48.26,14.71 RN4.4
N$26
  Top 0.305: IC2.47 40.96,20.64 41.84,19.75 RN5.1
N$27
  Top 0.305: IC2.46 40.32,20 41.04,19.29 RN5.2
N$28
  Top 0.305: IC2.44 39.05,20 40.24,18.82 RN5.3
N$29
  Top 0.305: IC2.43 38.42,19.37 39.37,18.41 39.37,14.71 RN5.4
N$30
  Top 0.305: IC2.41 37.15,16.83 37.47,16.51 37.47,14.71 RN6.1
N$31
  Top 0.305: IC2.40 36.51,14.73 RN6.2
N$32
  Top 0.305: IC2.38 35.24,20 35.8,19.45 RN6.3
N$33
  Top 0.305: IC2.37 34.61,18.73 34.92,18.41 34.92,14.71 RN6.4
N$34
  Top 0.305: IC2.36 33.97,15.67 RN7.1
N$35
  Top 0.305: RN7.2 32.15,15.64 33.02,16.51 33.02,20.32 33.34,20.64 IC2.35
N$36
  Top 0.305: IC2.33 32.07,20.64 32.38,20.32 32.38,17.14 31.35,16.11 RN7.3
N$37
  Top 0.305: IC2.32 31.43,20 31.75,19.68 31.75,17.78 30.55,16.58 RN7.4
N$38
  Top 0.305: IC2.30 30.16,20 28.5,18.34 RN8.1
N$39
  Top 0.305: IC2.29 29.53,20.64 27.7,18.82 RN8.2
N$40
  Top 0.305: IC2.27 28.26,20.64 26.91,19.29 RN8.3
N$41
  Top 0.305: IC2.26 27.62,21.27 26.11,19.75 RN8.4
N$42
  Top 0.305: RN1.8 65.97,5.15 SV1.1
N$43
  Top 0.305: RN1.7 65.17,8.02 64.77,7.62 64.77,3.81 SV1.2
N$44
  Top 0.305: RN1.6 64.37,8.49 63.5,7.62 SV1.3
N$45
  Top 0.305: RN1.5 63.57,8.96 62.23,7.62 62.23,3.81 SV1.4
N$46
  Top 0.305: RN5.8 41.84,12.77 43.18,11.43 SV1.19
N$47
  Top 0.305: RN2.8 60.89,5.15 SV1.5
N$48
  Top 0.305: RN2.7 60.09,6.75 59.69,6.35 59.69,3.81 SV1.6
N$49
  Top 0.305: RN2.6 59.29,8.49 58.42,7.62 SV1.7
N$50
  Top 0.305: RN2.5 58.49,8.96 57.15,7.62 57.15,6.35 SV1.9
N$51
  Top 0.305: RN3.7 55.01,9.29 53.34,7.62 SV1.11
N$52
  Top 0.305: RN5.7 41.04,12.3 41.91,11.43 41.91,3.81 SV1.20
N$53
  Top 0.305: RN3.8 55.81,7.55 54.61,6.35 54.61,3.81 SV1.10
N$54
  Top 0.305: RN3.5 53.41,10.23 50.8,7.62 SV1.13
N$55
  Top 0.305: RN3.6 54.21,9.76 52.07,7.62 52.07,3.81 SV1.12
N$56
  Top 0.305: RN4.7 49.93,9.93 48.26,8.26 SV1.15
N$57
  Top 0.305: RN4.8 50.73,9.46 49.53,8.26 49.53,3.81 SV1.14
N$58
  Top 0.305: RN4.6 49.13,10.39 46.35,7.62 46.35,5.71 SV1.17
N$59
  Top 0.305: RN5.5 39.44,3.74 SV1.22
N$60
  Top 0.305: RN5.6 40.24,11.2 40.64,10.79 SV1.21
N$61
  Top 0.305: RN4.5 48.33,10.87 44.45,6.99 44.45,3.81 SV1.18
N$62
  Top 0.305: RN8.5 26.11,12.13 21.59,7.62 21.59,3.81 SV1.36
N$63
  Top 0.305: RN10.8 14.64,10.76 19.05,6.35 19.05,3.81 SV1.38
N$64
  Top 0.305: RN6.6 35.8,9.12 34.29,7.62 34.29,3.81 SV1.26
N$65
  Top 0.305: RN6.8 37.4,12.13 38.1,11.43 SV1.23
N$66
  Top 0.305: RN7.8 32.95,10.09 31.75,8.89 31.75,3.81 SV1.28
N$67
  Top 0.305: RN6.7 36.59,6.12 SV1.25
N$68
  Top 0.305: RN11.5 20.32,9.63 SV1.37
N$69
  Top 0.305: RN10.5 10.23,9.46 12.7,6.99 13.34,6.99 13.97,6.35 13.97,3.81 SV1.42
N$70
  Top 0.305: RN6.5 34.99,9.6 33.02,7.62 SV1.27
N$71
  Top 0.305: RN10.7 11.83,10.39 12.7,9.53 14.61,9.53 17.78,6.35 SV1.39
N$72
  Top 0.305: RN9.7 7.86,11.2 8.26,10.79 8.26,8.89 11.43,5.71 11.43,3.81 SV1.44
N$73
  Top 0.305: SV1.43 12.7,5.71 8.89,9.53 8.89,11.43 8.32,11.99 RN9.8
N$74
  Top 0.61: 64.77,63.5 63.5,64.77 63.5,62.23 arc180 68.58,62.23 68.58,64.77 67.31,63.5
N$86
  Top 0.305: RN7.7 32.15,10.56 30.48,8.89 SV1.29
N$87
  Top 0.305: RN9.6 7.38,10.39 7.62,10.16 7.62,8.26 10.16,5.71 SV1.45
N$88
  Top 0.305: RN7.6 31.35,11.03 29.21,8.89 29.21,3.81 SV1.30
N$89
  Top 0.305: RN8.7 27.7,11.2 24.13,7.62 24.13,3.81 SV1.34
N$91
  Top 0.305: RN10.6 11.03,9.93 12.7,8.26 13.97,8.26 15.24,6.99 SV1.41
N$93
  Top 0.305: RN7.5 30.55,11.5 27.94,8.89 SV1.31
N$94
  Top 0.305: RN8.8 28.5,10.72 25.4,7.62 SV1.33
N$95
  Top 0.305: RN8.6 26.91,11.66 22.86,7.62 SV1.35
N$96
  Top 0.305: SV1.46 8.89,3.81 6.99,3.81 6.35,4.45 6.35,6.35 6.39,6.39 RN9.5
NHI  (via drill 0.6)
  Top 0.305: v17.78,55.88 VIDC_BOTTOM.49
  Bottom 0.305: VIDC_BOTTOM.49 v17.78,55.88
NHS  (via drill 0.6)
  Top 0.305: v17.78,50.8 VIDC_BOTTOM.45 11.43,50.8 7.62,54.61 5.08,54.61 JP2.7 | IC3.14 7.94,36.51 v8.26,36.83
  Bottom 0.305: v17.78,50.8 VIDC_BOTTOM.45 13.34,50.8 12.7,50.16 12.7,42.55 10.16,40.01 10.16,38.73 v8.26,36.83
NIBSEL  (via drill 0.6)
  Top 0.305: VIDC_BOTTOM.37 v24.13,52.07
  Bottom 0.305: v24.13,52.07 VIDC_BOTTOM.37
NSD0  (via drill 0.6)
  Top 0.305: VIDC_BOTTOM.33 v29.21,52.07
  Bottom 0.305: v29.21,52.07 VIDC_BOTTOM.33
NSD1  (via drill 0.6)
  Top 0.305: v27.94,50.8 VIDC_BOTTOM.34
  Bottom 0.305: VIDC_BOTTOM.34 v27.94,50.8
NSD2  (via drill 0.6)
  Top 0.305: VIDC_BOTTOM.35 v26.67,52.07
  Bottom 0.305: v26.67,52.07 VIDC_BOTTOM.35
NSD3  (via drill 0.6)
  Top 0.305: v25.4,50.8 VIDC_BOTTOM.36
  Bottom 0.305: VIDC_BOTTOM.36 v25.4,50.8
NSNDRQ  (via drill 0.6)
  Top 0.305: v19.05,52.07 VIDC_BOTTOM.46 12.06,52.07 8.26,55.88 JP2.6 | IC3.16 6.67,37.15 v8.26,38.73
  Bottom 0.305: v19.05,52.07 VIDC_BOTTOM.46 12.7,52.07 12.06,51.44 12.06,43.18 8.26,39.37 v8.26,38.73
NSUP  (via drill 0.6)
  Top 0.305: v17.78,43.18 VIDC_BOTTOM.42
  Bottom 0.305: VIDC_BOTTOM.42 v17.78,43.18
NVCS  (via drill 0.6)
  Top 0.305: v13.97,46.99 13.97,48.73 VIDC_BOTTOM.44 10.79,49.53 6.99,53.34 JP2.8 | IC3.13 8.57,34.61 v9.53,35.56
  Bottom 0.305: VIDC_BOTTOM.44 14.77,47.79 v13.97,46.99 13.97,42.55 11.43,40.01 11.43,37.47 v9.53,35.56
NVED0  (via drill 0.6)
  Top 0.305: v22.86,50.8 VIDC_BOTTOM.38
  Bottom 0.305: VIDC_BOTTOM.38 v22.86,50.8
NVED1  (via drill 0.6)
  Top 0.305: VIDC_BOTTOM.39 v21.59,52.07
  Bottom 0.305: v21.59,52.07 VIDC_BOTTOM.39
NVED2  (via drill 0.6)
  Top 0.305: v20.32,43.18 VIDC_BOTTOM.40
  Bottom 0.305: VIDC_BOTTOM.40 v20.32,43.18
NVED3  (via drill 0.6)
  Top 0.305: VIDC_BOTTOM.41 v19.05,44.45
  Bottom 0.305: v19.05,44.45 VIDC_BOTTOM.41
NVIDRQ  (via drill 0.6)
  Top 0.305: v17.78,53.34 VIDC_BOTTOM.47 12.7,53.34 8.89,57.15 5.08,57.15 JP2.5 | IC3.17 6.03,38.42 v6.35,38.73
  Bottom 0.305: v17.78,53.34 VIDC_BOTTOM.47 12.06,53.34 11.43,52.7 11.43,43.81 v6.35,38.73
NVIDW  (via drill 0.6)
  Top 0.305: 16.51,46.35 v16.51,44.45 | VIDC_BOTTOM.43 16.51,46.35 | JP2.9 9.53,45.09 15.24,45.09 16.51,46.35 | IC3.12 9.21,32.7 v10.16,33.66
  Bottom 0.305: v16.51,44.45 16.51,46.35 | 16.51,46.35 VIDC_BOTTOM.43 | v10.16,33.66 13.34,36.83 13.34,40.01 15.24,41.91 15.24,45.09 16.51,46.35
RCH+  (via drill 0.6)
  Top 0.305: VIDC_BOTTOM.56 v19.05,64.77
  Bottom 0.305: v19.05,64.77 VIDC_BOTTOM.56
RCH-  (via drill 0.6)
  Top 0.305: VIDC_BOTTOM.54 v19.05,62.23
  Bottom 0.305: v19.05,62.23 VIDC_BOTTOM.54
RNL  (via drill 0.6)
  Top 0.305: v17.78,60.96 VIDC_BOTTOM.53
  Bottom 0.305: VIDC_BOTTOM.53 v17.78,60.96
ROUT  (via drill 0.6)
  Top 0.305: VIDC_BOTTOM.31 v31.75,52.07
  Bottom 0.305: v31.75,52.07 VIDC_BOTTOM.31
RSDAC  (via drill 0.6)
  Top 0.305: VIDC_BOTTOM.58 v19.05,67.31
  Bottom 0.305: v19.05,67.31 VIDC_BOTTOM.58
RVDAC  (via drill 0.6)
  Top 0.305: VIDC_BOTTOM.27 36.83,45.72 v38.1,44.45
  Bottom 0.305: v38.1,44.45 36.83,45.72 VIDC_BOTTOM.27
SINK  (via drill 0.6)
  Top 0.305: VIDC_BOTTOM.50 v19.05,57.15
  Bottom 0.305: v19.05,57.15 VIDC_BOTTOM.50
SNDAK  (via drill 0.6)
  Top 0.305: VIDC_BOTTOM.61 v16.51,74.3 12.06,74.3 6.35,68.58 JP2.2 | IC3.22 2.86,40.96 v6.35,44.45
  Bottom 0.305: VIDC_BOTTOM.61 v16.51,74.3 | v6.35,44.45 9.53,47.62 9.53,59.05 7.62,60.96 JP2.2
VDDS  (via drill 0.6)
  Top 0.305: v17.78,68.58 VIDC_BOTTOM.59
  Bottom 0.305: VIDC_BOTTOM.59 v17.78,68.58
VIDAK  (via drill 0.6)
  Top 0.305: VIDC_BOTTOM.62 17.78,75.56 v17.46,75.88 12.38,75.88 3.81,67.31 JP2.1 | IC3.23 2.22,42.23 v4.45,44.45
  Bottom 0.305: VIDC_BOTTOM.62 17.78,75.56 v17.46,75.88 | JP2.1 5.08,59.69 7.62,59.69 8.89,58.42 8.89,48.9 v4.45,44.45

### Text on the board
Top: 310821 v1 | VIDC interposer
Bottom: (c) 2021 Matt Evans